# EAGLE design cdf-teensy-interrupter (EAGLE 7.3.0)
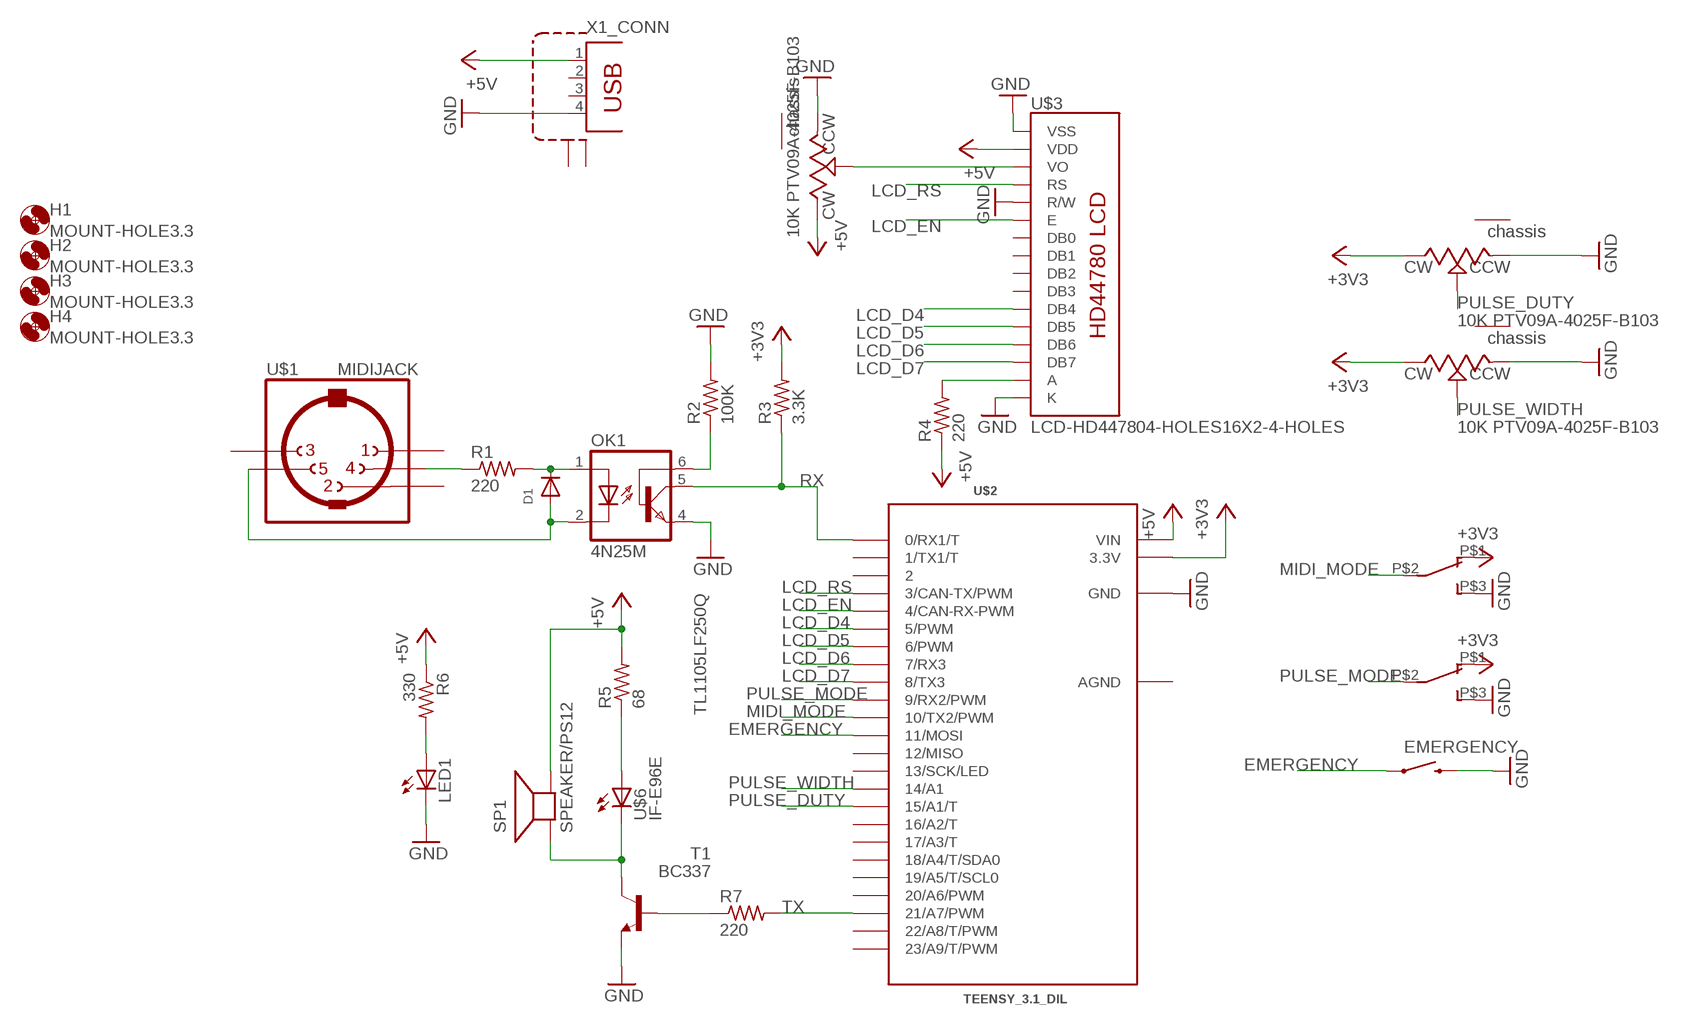
[diagram p0: schematic, sheet 1]

## Parts
D1  DIODEDO-1N4148  [DO-1N4148]
EMERGENCY  SWITCH-MOMENTARY-2PTH  [TACTILE-PTH]
H1  MOUNT-HOLE3.3  [3,3]
H2  MOUNT-HOLE3.3  [3,3]
H3  MOUNT-HOLE3.3  [3,3]
H4  MOUNT-HOLE3.3  [3,3]
LCD_BL  10K PTV09A-4025F-B103  POTENTIOMETERPTV09A_VERTICAL  [PTV09A-4]
LED1  LED5MM  [LED5MM]
MIDI_MODE  100SP1T1B4M2QE  [100SP1T1B4M2QE]
OK1  4N25M  [DIL06]
PULSE_DUTY  10K PTV09A-4025F-B103  POTENTIOMETERPTV09A_VERTICAL  [PTV09A-4]
PULSE_MODE  100SP1T1B4M2QE  [100SP1T1B4M2QE]
PULSE_WIDTH  10K PTV09A-4025F-B103  POTENTIOMETERPTV09A_VERTICAL  [PTV09A-4]
R1  220  R-US_0204/7  [0204/7]
R2  100K  R-US_0204/7  [0204/7]
R3  3.3K  R-US_0204/7  [0204/7]
R4  220  R-US_0204/7  [0204/7]
R5  68  R-US_0204/7  [0204/7]
R6  330  R-US_0204/7  [0204/7]
R7  220  R-US_0204/7  [0204/7]
SP1  SPEAKER/PS12  [PS12]
T1  BC337  [TO92]
U$1  MIDIJACK  [CP-2350]
U$2  TEENSY_3.1_DIL  [TEENSY3-DIL]
U$3  LCD-HD447804-HOLES16X2-4-HOLES  [LCD-16X2-4HOLES]
U$6  IF-E96E  [IF-E96E]
X1  TE-292304-1  [TE-292304-1]

## Nets
+3V3: MIDI_MODE.P$1 PULSE_DUTY.3(CW) PULSE_MODE.P$1 PULSE_WIDTH.3(CW) R3.2 U$2.3.3V
+5V: LCD_BL.3(CW) R4.1 R5.2 R6.1 SP1.P$2(-) U$2.VIN U$3.2(VDD) X1.1
EMERGENCY: EMERGENCY.1 U$2.11(11/MOSI)
GND: EMERGENCY.3 LCD_BL.1(CCW) LED1.K(C) MIDI_MODE.P$3 OK1.4(EMI) PULSE_DUTY.1(CCW) PULSE_MODE.P$3 PULSE_WIDTH.1(CCW) R2.2 T1.1(E) U$2.GND U$3.1(VSS) U$3.5(R/W) U$3.16(K) X1.4
LCD_D4: U$2.5(5/PWM) U$3.11(DB4)
LCD_D5: U$2.6(6/PWM) U$3.12(DB5)
LCD_D6: U$2.7(7/RX3) U$3.13(DB6)
LCD_D7: U$2.8(8/TX3) U$3.14(DB7)
LCD_EN: U$2.4(4/CAN-RX-PWM) U$3.6(E)
LCD_RS: U$2.3(3/CAN-TX/PWM) U$3.4(RS)
MIDI_MODE: MIDI_MODE.P$2 U$2.10(10/TX2/PWM)
N$1: R1.1 U$1.4
N$2: D1.C OK1.1(A) R1.2
N$3: D1.A OK1.2(C) U$1.5
N$4: OK1.6(BAS) R2.1
N$5: LCD_BL.2(WIPER) U$3.3(VO)
N$6: R4.2 U$3.15(A)
N$7: R7.1 T1.2(B)
N$8: R5.1 U$6.P$2_ANODE+(A)
N$9: LED1.A R6.2
N$11: SP1.P$1(+) T1.3(C) U$6.P$1_CATHODE-(C)
PULSE_DUTY: PULSE_DUTY.2(WIPER) U$2.15/A1(15/A1/T)
PULSE_MODE: PULSE_MODE.P$2 U$2.9(9/RX2/PWM)
PULSE_WIDTH: PULSE_WIDTH.2(WIPER) U$2.14/A0(14/A1)
RX: OK1.5(COL) R3.1 U$2.0(0/RX1/T)
TX: R7.2 U$2.21/A7(21/A7/PWM)
Unconnected: LCD_BL.4(CHASSIS) PULSE_DUTY.4(CHASSIS) PULSE_WIDTH.4(CHASSIS) U$1.1 U$1.2 U$1.3 U$2.1(1/TX1/T) U$2.2 U$2.12(12/MISO) U$2.13(13/SCK/LED) U$2.16/A2(16/A2/T) U$2.17/A3(17/A3/T) U$2.18/A4(18/A4/T/SDA0) U$2.19/A5(19/A5/T/SCL0) U$2.20/A6(20/A6/PWM) U$2.22/A8(22/A8/T/PWM) U$2.23/A9(23/A9/T/PWM) U$3.7(DB0) U$3.8(DB1) U$3.9(DB2) U$3.10(DB3) X1.2 X1.3 X1.P$1(SHIELD:S1) X1.P$2(SHIELD:S2)

## Notes on the sheet
- TL1105LF250Q

## Power pins joined to a net without a drawn wire
AGND: U$2.AGND

## Library data of the parts
D1 = adafruit:DIODE: Diode SMADIODE - SMA Surface Mount Package 20V 1A Schottky Diode Digikey: 641-1014-6-ND DO-1N4148 - Through Hole Small Current Diode SOD-123 20V 1 A (.5mV Vf) Schottky Diode - Digikey: MBRX120TPMSCT-ND SOD-323 10V 570mA (.38mV Vf, 3ns) Schottky Diode - Digikey: ZLLS410CT-ND SOD-523 30V 30mA Schottky Diode (RB751S-40TE61) - Digikey: RB751S-40TE61CT-ND SOT23-R/W - SOT23 Package (R = Solder Paste/Reflow Ovens, W = Hand-Soldering) BAT54Film 40V 300mA - Digikey: 497-7162-1-ND
EMERGENCY = SparkFun-Electromechanical:SWITCH-MOMENTARY-2: Various NO switches- pushbuttons, reed, etc; PROD_ID: SWCH-08441
H1-H4 = holes:MOUNT-HOLE: MOUNTING HOLE with drill center marker
LCD_BL PULSE_DUTY PULSE_WIDTH = Bourns:POTENTIOMETER
LED1 = adafruit:LED: LED OSRAM: - CHIPLED LG R971, LG N971, LY N971, LG Q971, LY Q971, LO R971, LY R971 LH N974, LH R974 LS Q976, LO Q976, LY Q976 LO Q996 - Hyper CHIPLED LW Q18S LB Q993, LB Q99A, LB R99A - SideLED LS A670, LO A670, LY A670, LG A670, LP A670 LB A673, LV A673, LT A673, LW A673 LH A674 LY A675 LS A676, LA A676, LO A676, LY A676, LW A676 LS A679, LY A679, LG A679 - Hyper Micro SIDELED® LS Y876, LA Y876, LO Y876, LY Y876 LT Y87S - SmartLED LW L88C, LW L88S LB L89C, LB L89S, LG L890 LS L89K, LO L89K, LY L89K LS L896, LA L896, LO L896, LY L896 - TOPLED LS T670, LO T670, LY T670, LG T670, LP T670 LSG T670, LSP T670, LSY T670, LOP T670, LYG T670 LG T671, LOG T671, LSG T671 LB T673, LV T673, LT T673, LW T673 LH T674 LS T676, LA T676, LO T676, LY T676, LB T676, LH T676, LSB T676, LW T676 LB T67C, LV T67C, LT T67C, LS T67K, LO T67K, LY T67K, LW E67C LS E67B, LA E67B, LO E67B, LY E67B, LB E67C, LV E67C, LT E67C LW T67C LS T679, LY T679, LG T679 LS T770, LO T770, LY T770, LG T770, LP T770 LB T773, LV T773, LT T773, LW T773 LH T774 LS E675, LA E675, LY E675, LS T675 LS T776, LA T776, LO T776, LY T776, LB T776 LHGB T686 LT T68C, LB T68C - Hyper Mini TOPLED® LB M676 - Mini TOPLED Santana® LG M470 LS M47K, LO M47K, LY M47K Source: http://www.osram.convergy.de/
MIDI_MODE PULSE_MODE = keves:100SP1T1B4M2QE: 100SP1T1B4M2QE SPDT SWITCH
OK1 = optocoupler:4N*?M: General Purpose 6-Pin Phototransistor Optocouplers Source: http://www.fairchildsemi.com/ds/4N/4N35-M.pdf; MPN: 4N25-M; OC_FARNELL: 1021349; OC_NEWARK: 98K9084
R1-R7 = rcl:R-US_: RESISTOR, American symbol
SP1 = adafruit:SPEAKER: SPEAKER Source: Buerklin Added PS12 (for part # PS1240 piezo) http://www.ladyada.net/library/pcb/eaglelibrary.html
T1 = transistor:BC337: NPN TRANSISTOR
U$1 = keves:MIDIJACK: DIN 5 jack also known as MIDI jack A modification of conn-hirshman:MAB5SH with two options for the grounding 'teeth'
U$2 = Teensy_3_and_LC_Series_Boards_v1.1:TEENSY_3.1_DIL: Teensy 3.1 or 3.2 in a DIL Layout.
U$3 = HD44780LCD:LCD-HD44780
U$6 = keves:IF-E96E
X1 = keves:TE-292304-1: USB A Female connector; MPN: 292304-1

## Board
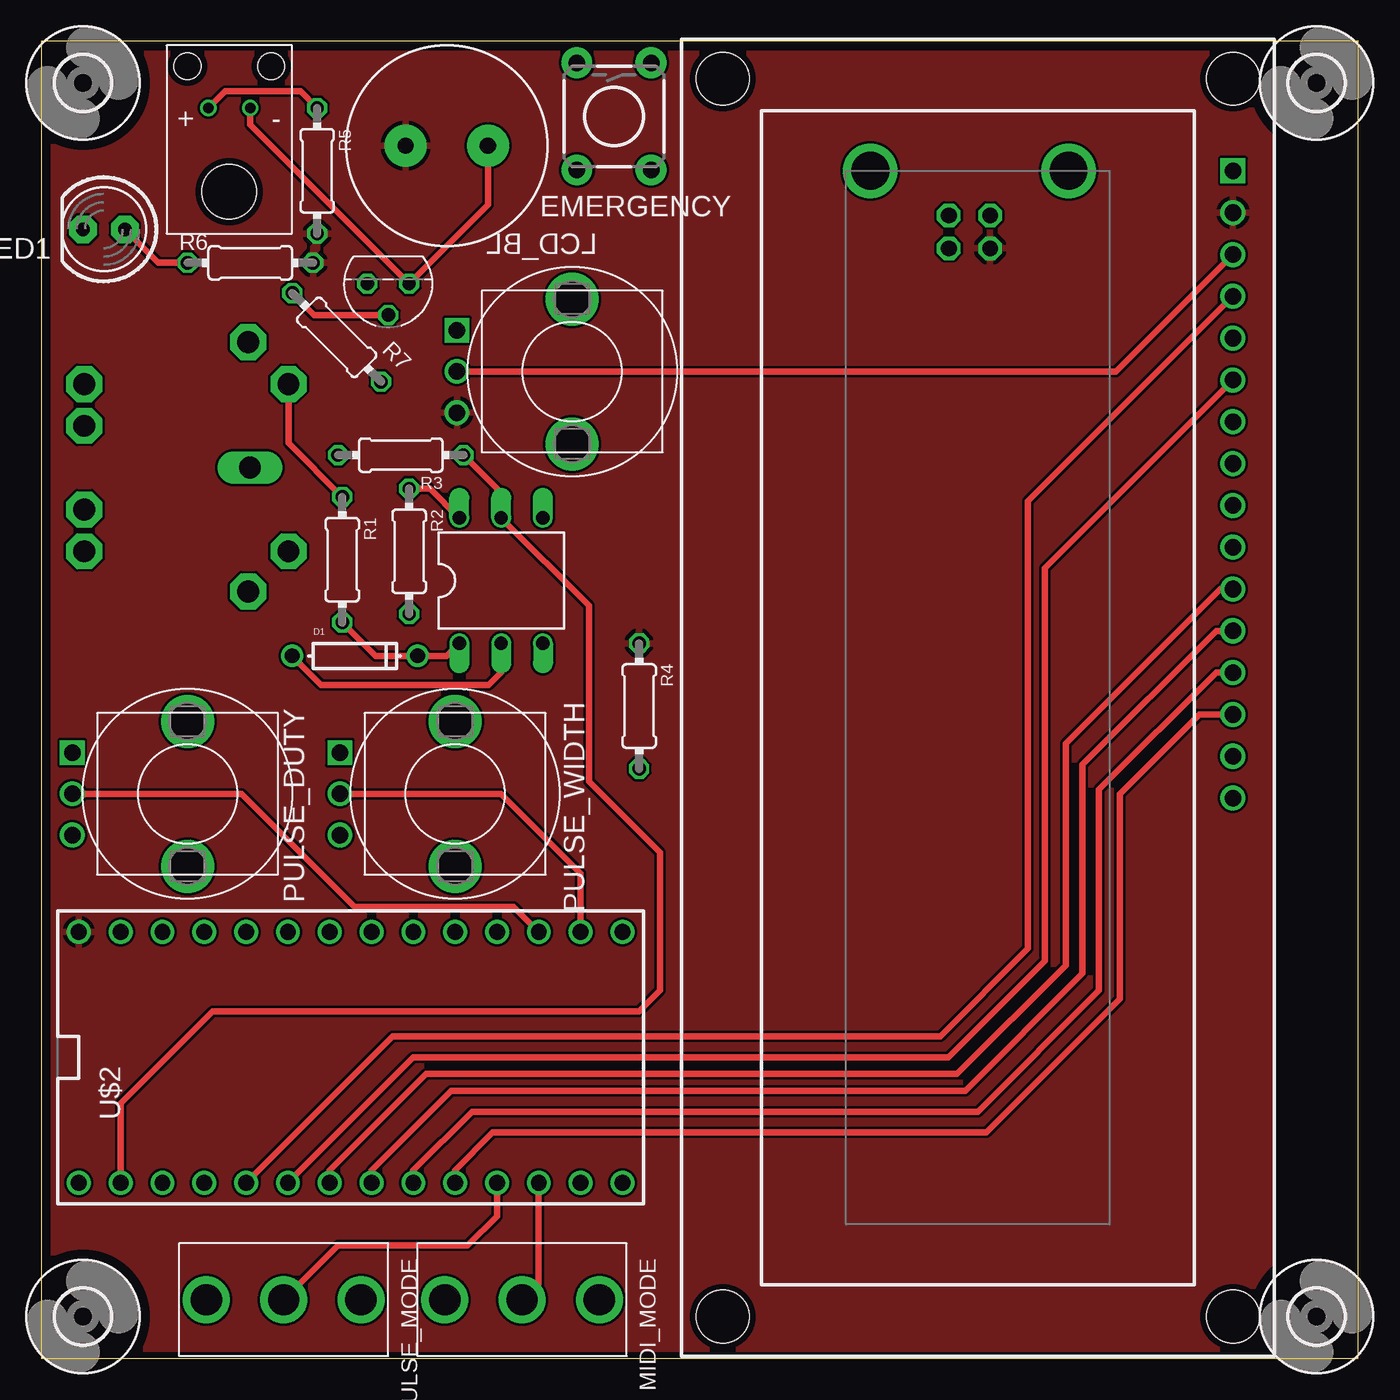
[diagram p1: board, top side]
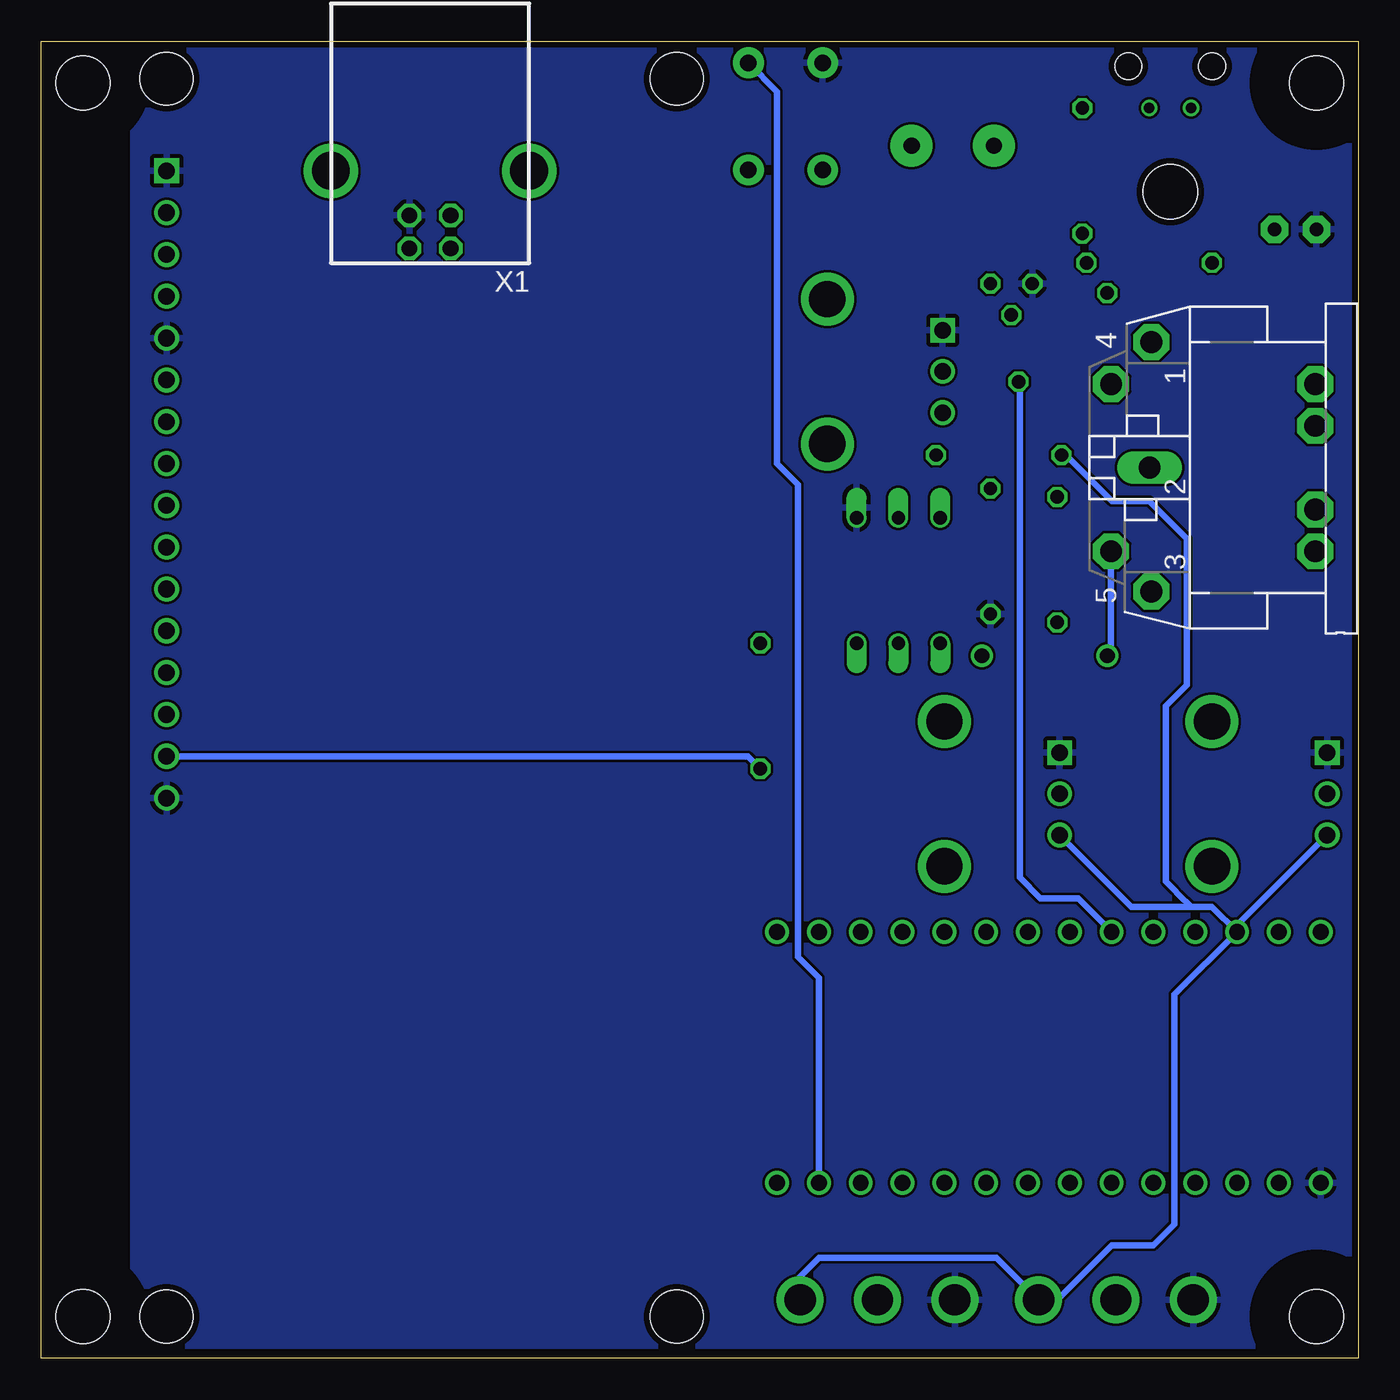
[diagram p2: board, bottom side, seen from below]

Size 80.01 x 80.01 mm. Coordinates in mm from the lower left corner, seen from the top.
Outline: 0,0 80.01,0 80.01,80.01 0,80.01 0,0
Copper layers (1*16): Top 0.0356mm / dielectric 1.5011mm / Bottom 0.0356mm
Design rules "oshpark *": minimum track width 6mil, minimum drill 13mil, track to track 6mil, track to pad 6mil, pad to pad 6mil, via to via 6mil, smd to smd 6mil, copper to edge 15mil, drill to drill 6mil, minimum pad ring 7mil, minimum via ring 7mil, stop-mask expansion 3mil, vias tented up to drill 0mil, thermal gap 10mil

### Footprints (pad centres in the part's own frame; a part is rotated, then mirrored left to right if it is on the bottom)
DO-1N4148 = drill 0.9: A -3.81,0; C 3.81,0
TACTILE-PTH = drill 1.016 pad 1.88: 1 -3.251,2.261; 2 3.251,2.261; 3 -3.251,-2.261; 4 3.251,-2.261
3,3 = hole 3.3: 0,0
PTV09A-4 = drill 1 square: 1 -2.5,-7 | drill 1: 2 0,-7; 3 2.5,-7 | drill 2.2: 4 -4.4,0; 5 4.4,0
LED5MM = drill 0.813 pad 1.676 octagon: A -1.27,0; K 1.27,0
100SP1T1B4M2QE = drill 1.905: P$1 -4.699,0; P$2 0,0; P$3 4.699,0
DIL06 = drill 0.813 offset: 1 -2.54,-3.81; 2 0,-3.81; 3 2.54,-3.81; 4 2.54,3.81; 5 0,3.81; 6 -2.54,3.81
0204/7 = drill 0.813 octagon: 1 -3.81,0; 2 3.81,0
PS12 = drill 1 pad 2.54: P$1 -2.5,0; P$2 2.5,0
TO92 = drill 0.813 octagon: 1 1.27,0; 2 0,1.905; 3 -1.27,0
CP-2350 = drill 1.321 pad 2.184 octagon: 1 7.62,12.58; 3 -7.52,12.58; 4 5.08,15.02; 5 -5.08,15.02; PE -2.54,2.62; PE1 -5.08,2.62; PE2 5.08,2.62; PE@ 2.54,2.62 | drill 1.321 long: 2 0,12.68
TEENSY3-DIL = drill 0.965: 0 -7.62,13.97; 1 -7.62,11.43; 2 -7.62,8.89; 3 -7.62,6.35; 3.3V 7.62,11.43; 4 -7.62,3.81; 5 -7.62,1.27; 6 -7.62,-1.27; 7 -7.62,-3.81; 8 -7.62,-6.35; 9 -7.62,-8.89; 10 -7.62,-11.43; 11 -7.62,-13.97; 12 -7.62,-16.51; 13 7.62,-16.51; 14/A0 7.62,-13.97; 15/A1 7.62,-11.43; 16/A2 7.62,-8.89; 17/A3 7.62,-6.35; 18/A4 7.62,-3.81; 19/A5 7.62,-1.27; 20/A6 7.62,1.27; 21/A7 7.62,3.81; 22/A8 7.62,6.35; 23/A9 7.62,8.89; AGND 7.62,13.97; GND -7.62,16.51; VIN 7.62,16.51
LCD-16X2-4HOLES = drill 1.016 square: 1 -32,15.5 | drill 1.016: 2 -29.46,15.5; 3 -26.92,15.5; 4 -24.38,15.5; 5 -21.84,15.5; 6 -19.3,15.5; 7 -16.76,15.5; 8 -14.22,15.5; 9 -11.68,15.5; 10 -9.14,15.5; 11 -6.6,15.5; 12 -4.06,15.5; 13 -1.52,15.5; 14 1.02,15.5; 15 3.56,15.5; 16 6.1,15.5 | hole 3.2: -37.6,15.5; -37.6,-15.5; 37.6,-15.5; 37.6,15.5
IF-E96E = drill 0.635: P$1_CATHODE- 1.27,-2.54; P$2_ANODE+ -1.27,-2.54 | hole 3.302: 0,-7.62 | hole 1.626: 2.54,0; -2.54,0
TE-292304-1 = drill 0.95 octagon: 1 1.25,4.71; 2 -1.25,4.71; 3 -1.25,2.71; 4 1.25,2.71 | drill 2.3: P$1 6.02,0; P$2 -6.02,0

### Placement (x,y rotation side)
D1  19.05,42.67 0 top
EMERGENCY  34.8,75.44 270 top
H1  2.54,2.54 0 top
H2  2.54,77.47 0 top
H3  77.47,2.54 0 top
H4  77.47,77.47 0 top
LCD_BL  32.26,59.94 270 top
LED1  3.81,68.58 180 top
MIDI_MODE  29.21,3.56 180 top
OK1  27.94,47.24 0 top
PULSE_DUTY  8.89,34.29 270 top
PULSE_MODE  14.73,3.56 180 top
PULSE_WIDTH  25.15,34.29 270 top
R1  18.29,48.51 270 top
R2  22.35,49.02 270 top
R3  21.84,54.86 180 top
R4  36.32,39.62 270 top
R5  16.76,72.14 270 top
R6  12.7,66.55 180 top
R7  17.95,62.02 315 top
SP1  24.64,73.66 180 top
T1  21.08,65.28 180 top
U$1  0,54.1 90 bottom
U$2  18.8,18.29 90 top
U$3  56.9,40.13 270 top
U$6  11.43,78.49 0 top
X1  56.39,72.14 180 bottom

### Tracks (layer width: path | path; a pad name or v marks a point on that pad's centre or on a via)
+3V3
  Bottom 0.406: MIDI_MODE.P$1 33.91,4.95 32.77,6.1 21.97,6.1 PULSE_MODE.P$1 18.29,3.56 14.99,6.86 12.45,6.86 11.18,8.13 11.18,22.1 U$2.3.3V | PULSE_DUTY.3 7.37,26.31 U$2.3.3V | PULSE_WIDTH.3 13.79,27.43 10.16,27.43 | 10.16,27.43 8.89,27.43 U$2.3.3V | R3.2 17.78,54.86 14.99,52.07 12.7,52.07 10.41,49.78 10.41,40.89 11.68,39.62 11.68,28.96 11.18,28.45 10.92,28.19 10.16,27.43
+5V
  pour Top: 0.76,0.51 74.68,0.51 74.68,79.25 0.76,79.25 0.76,0.76
EMERGENCY
  Bottom 0.406: U$2.11 32.77,23.11 34.04,24.38 34.04,53.09 35.31,54.36 35.31,76.94 EMERGENCY.1
GND
  pour Bottom: 0.51,0.76 74.42,0.76 74.42,79.5 0.51,79.5 0.51,1.02
LCD_D4
  Top 0.406: U$3.11 71.62,46.73 62.23,37.34 62.23,23.88 55.63,17.27 23.37,17.27 17.53,11.43 U$2.5
LCD_D5
  Top 0.406: U$3.12 71.37,44.19 63.25,36.07 63.25,23.37 56.13,16.26 24.89,16.26 20.07,11.43 U$2.6
LCD_D6
  Top 0.406: U$3.13 71.37,41.65 64.26,34.54 64.26,22.35 56.9,14.99 26.16,14.99 22.61,11.43 U$2.7
LCD_D7
  Top 0.406: U$3.14 70.35,39.11 65.53,34.29 65.53,21.84 57.4,13.72 27.43,13.72 25.15,11.43 U$2.8
LCD_EN
  Top 0.406: U$2.4 22.61,18.29 55.12,18.29 60.96,24.13 60.96,37.08 60.96,37.59 60.96,48 U$3.6
LCD_RS
  Top 0.406: U$2.3 21.34,19.56 54.61,19.56 59.94,24.89 59.94,48.01 59.94,48.26 59.94,52.06 U$3.4
MIDI_MODE
  Top 0.406: U$2.10 30.23,4.57 MIDI_MODE.P$2
N$1
  Top 0.406: U$1.4 15.02,55.59 R1.1
N$2
  Top 0.406: OK1.1 24.64,42.67 D1.C 20.32,42.67 R1.2
N$3
  Top 0.406: OK1.2 27.94,41.66 27.18,40.89 17.02,40.89 D1.A
  Bottom 0.406: U$1.5 15.02,42.89 D1.A
N$4
  Top 0.406: R2.1 23.62,52.83 OK1.6
N$5
  Top 0.406: LCD_BL.2 65.29,59.94 U$3.3
N$6
  Bottom 0.406: U$3.15 37.08,36.57 R4.2
N$7
  Top 0.406: T1.2 16.59,63.37 R7.1
N$8
  Top 0.406: R5.1 15.75,76.96 11.18,76.96 U$6.P$2_ANODE+
N$9
  Top 0.406: LED1.A 7.11,66.55 R6.2
N$11
  Top 0.406: SP1.P$1 27.14,70.06 T1.3 12.7,74.93 U$6.P$1_CATHODE-
PULSE_DUTY
  Top 0.406: PULSE_DUTY.2 12.19,34.29 19.05,27.43 28.7,27.43 U$2.15/A1
PULSE_MODE
  Top 0.406: U$2.9 27.69,8.64 25.91,6.86 18.03,6.86 PULSE_MODE.P$2
PULSE_WIDTH
  Top 0.406: U$2.14/A0 32.77,29.46 27.94,34.29 PULSE_WIDTH.2
RX
  Top 0.406: U$2.0 4.83,15.49 10.41,21.08 36.32,21.08 37.59,22.35 37.59,30.73 33.27,35.05 33.27,45.72 OK1.5 27.94,52.58 R3.1
TX
  Bottom 0.406: U$2.21/A7 14.99,26.16 15.24,26.16 17.02,27.94 19.3,27.94 20.57,29.21 20.57,59.26 R7.2